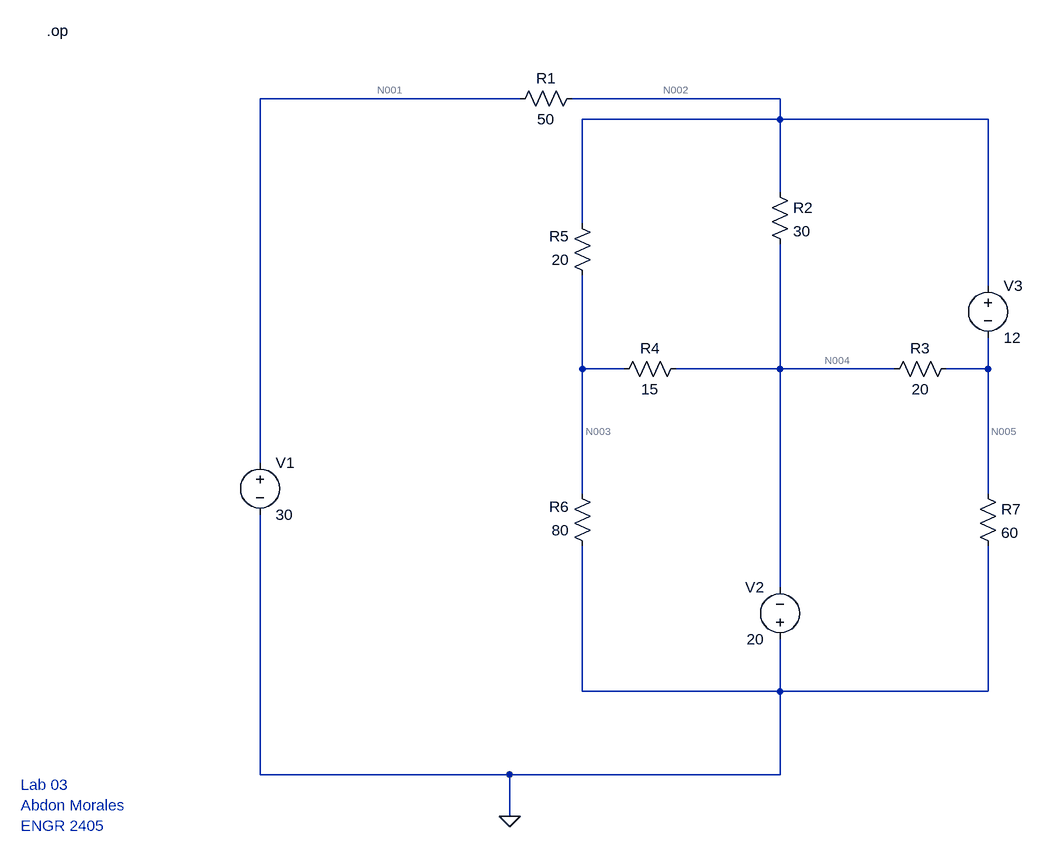
[diagram p0: schematic Lab03-Morales-Abdon.asc]
Lab03-Morales-Abdon.asc, the LTspice schematic file:
Version 4.1
SHEET 1 1240 740
WIRE 464 -448 64 -448
WIRE 864 -448 544 -448
WIRE 864 -416 864 -448
WIRE 864 -416 560 -416
WIRE 1184 -416 864 -416
WIRE 864 -304 864 -416
WIRE 560 -256 560 -416
WIRE 1184 -160 1184 -416
WIRE 560 -32 560 -176
WIRE 624 -32 560 -32
WIRE 864 -32 864 -224
WIRE 864 -32 704 -32
WIRE 1040 -32 864 -32
WIRE 1184 -32 1184 -80
WIRE 1184 -32 1120 -32
WIRE 64 112 64 -448
WIRE 560 160 560 -32
WIRE 1184 160 1184 -32
WIRE 864 304 864 -32
WIRE 560 464 560 240
WIRE 864 464 864 384
WIRE 864 464 560 464
WIRE 1184 464 1184 240
WIRE 1184 464 864 464
WIRE 64 592 64 192
WIRE 448 592 64 592
WIRE 864 592 864 464
WIRE 864 592 448 592
WIRE 448 656 448 592
FLAG 448 656 0
SYMBOL voltage 64 96 R0
WINDOW 123 0 0 Left 0
WINDOW 39 0 0 Left 0
SYMATTR InstName V1
SYMATTR Value 30
SYMBOL voltage 864 400 R180
WINDOW 0 24 96 Left 2
WINDOW 3 24 16 Left 2
WINDOW 123 0 0 Left 0
WINDOW 39 0 0 Left 0
SYMATTR InstName V2
SYMATTR Value 20
SYMBOL voltage 1184 -176 R0
WINDOW 123 0 0 Left 0
WINDOW 39 0 0 Left 0
SYMATTR InstName V3
SYMATTR Value 12
SYMBOL res 560 -464 R90
WINDOW 0 0 56 VBottom 2
WINDOW 3 32 56 VTop 2
SYMATTR InstName R1
SYMATTR Value 50
SYMBOL res 848 -320 R0
SYMATTR InstName R2
SYMATTR Value 30
SYMBOL res 1136 -48 R90
WINDOW 0 0 56 VBottom 2
WINDOW 3 32 56 VTop 2
SYMATTR InstName R3
SYMATTR Value 20
SYMBOL res 720 -48 R90
WINDOW 0 0 56 VBottom 2
WINDOW 3 32 56 VTop 2
SYMATTR InstName R4
SYMATTR Value 15
SYMBOL res 576 -160 R180
WINDOW 0 36 76 Left 2
WINDOW 3 36 40 Left 2
SYMATTR InstName R5
SYMATTR Value 20
SYMBOL res 576 256 R180
WINDOW 0 36 76 Left 2
WINDOW 3 36 40 Left 2
SYMATTR InstName R6
SYMATTR Value 80
SYMBOL res 1168 144 R0
SYMATTR InstName R7
SYMATTR Value 60
TEXT -264 -552 Left 2 !.op
TEXT -304 608 Left 2 ;Lab 03\nAbdon Morales\nENGR 2405

The netlist it stands for:
* Lab03-Morales-Abdon.asc
V1 N001 0 30
V2 0 N004 20
V3 N002 N005 12
R1 N002 N001 50
R2 N002 N004 30
R3 N005 N004 20
R4 N004 N003 15
R5 N003 N002 20
R6 0 N003 80
R7 N005 0 60
.op
* Lab 03
* Abdon Morales
* ENGR 2405
.backanno
.end

* Results of the author's LTspice run, read from the files saved beside the schematic
* Operating Point:
*   V(n001) = 30 V
*   V(n002) = -5.196 V
*   V(n003) = -12.33 V
*   V(n004) = -20 V
*   V(n005) = -17.2 V
*   I(R1) = -703.9 mA
*   I(R2) = 493.5 mA
*   I(R3) = 140.2 mA
*   I(R4) = -511.1 mA
*   I(R5) = -356.9 mA
*   I(R6) = 154.2 mA
*   I(R7) = -286.6 mA
*   I(V1) = -703.9 mA
*   I(V2) = -1.145 A
*   I(V3) = -146.4 mA